# Altium schematic sheet Main.SchDoc: PCB design of fabric rolling machine
size A4; SheetNumber: 1; SheetTotal: 5
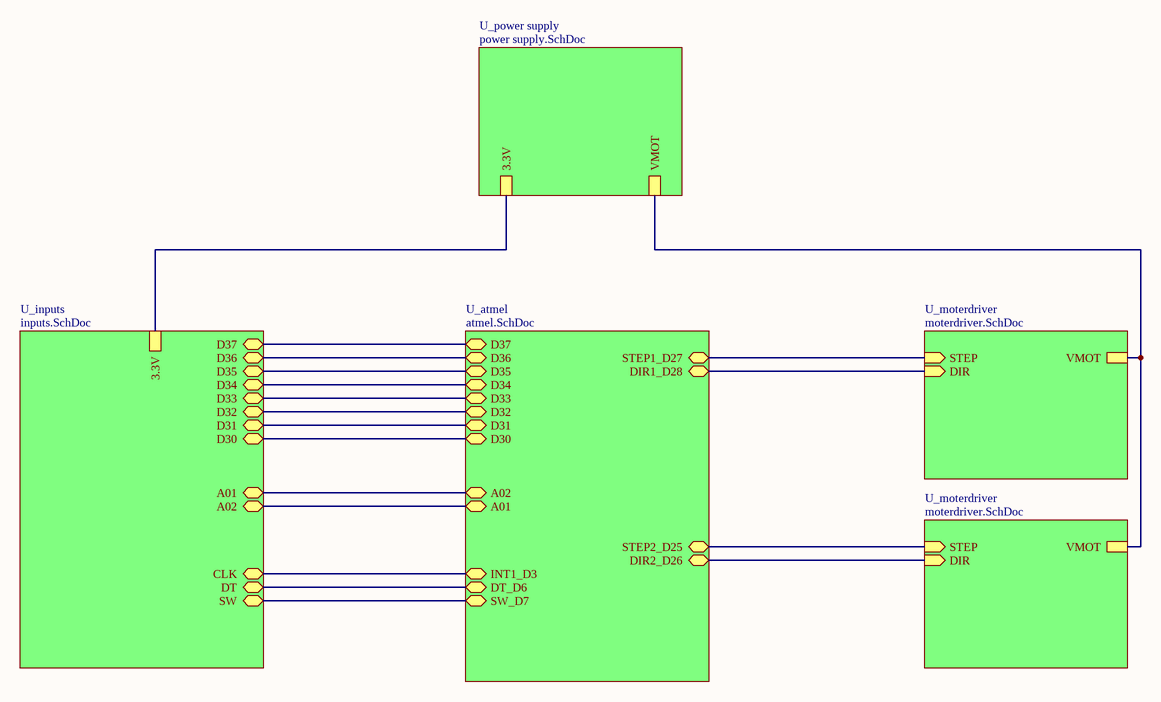
[diagram p0: Main.SchDoc]

## Sub-sheets
U_atmel = atmel.SchDoc: D37 (bidir), D36 (bidir), D35 (bidir), D34 (bidir), D33 (bidir), D32 (bidir), D31 (bidir), D30 (bidir), A02 (bidir), A01 (bidir), STEP2_D25 (bidir), DIR2_D26 (bidir), STEP1_D27 (bidir), DIR1_D28 (bidir), INT1_D3 (bidir), DT_D6 (bidir), SW_D7 (bidir)
U_inputs = inputs.SchDoc: D30 (bidir), D31 (bidir), D32 (bidir), D33 (bidir), D34 (bidir), D35 (bidir), D36 (bidir), D37 (bidir), A01 (bidir), A02 (bidir), CLK (bidir), SW (bidir), 3.3V, DT (bidir)
U_moterdriver = moterdriver.SchDoc: VMOT, STEP (in), DIR (in)
U_moterdriver = moterdriver.SchDoc: VMOT, STEP (in), DIR (in)
U_power supply = power supply.SchDoc: 3.3V, VMOT

## Nets
(unnamed): sheet U_power supply/3.3V, sheet U_inputs/3.3V
(unnamed): sheet U_power supply/VMOT, sheet U_moterdriver/VMOT, sheet U_moterdriver/VMOT
(unnamed): sheet U_atmel/D37, sheet U_inputs/D37
(unnamed): sheet U_atmel/D36, sheet U_inputs/D36
(unnamed): sheet U_atmel/D35, sheet U_inputs/D35
(unnamed): sheet U_atmel/D34, sheet U_inputs/D34
(unnamed): sheet U_atmel/D33, sheet U_inputs/D33
(unnamed): sheet U_atmel/D32, sheet U_inputs/D32
(unnamed): sheet U_atmel/D31, sheet U_inputs/D31
(unnamed): sheet U_atmel/D30, sheet U_inputs/D30
(unnamed): sheet U_atmel/A02, sheet U_inputs/A01
(unnamed): sheet U_atmel/A01, sheet U_inputs/A02
(unnamed): sheet U_atmel/STEP2_D25, sheet U_moterdriver/STEP
(unnamed): sheet U_atmel/DIR2_D26, sheet U_moterdriver/DIR
(unnamed): sheet U_atmel/STEP1_D27, sheet U_moterdriver/STEP
(unnamed): sheet U_atmel/DIR1_D28, sheet U_moterdriver/DIR
(unnamed): sheet U_atmel/INT1_D3, sheet U_inputs/CLK
(unnamed): sheet U_atmel/DT_D6, sheet U_inputs/DT
(unnamed): sheet U_atmel/SW_D7, sheet U_inputs/SW